# EAGLE schematic Emat (EAGLE 7.5.0)
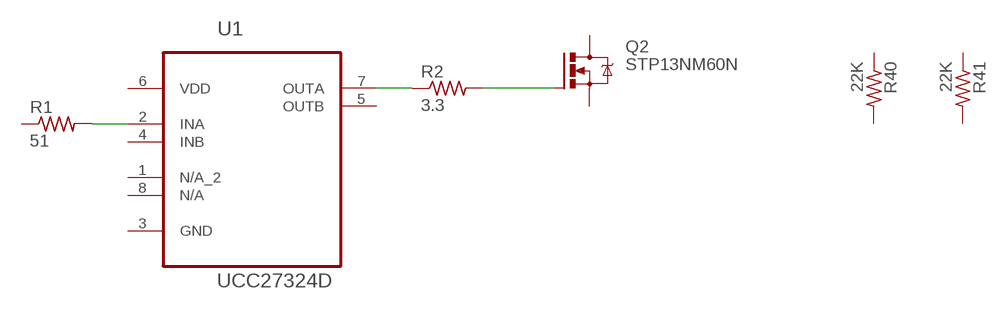
[diagram p0: schematic, sheet 1]

## Parts
Q2  STP13NM60N  [TO220BV]
R1  51  R-US_R1206  [R1206]
R2  3.3  R-US_R1206  [R1206]
R40  22K  R-US_R2512  [R2512]
R41  22K  R-US_R2512  [R2512]
U1  UCC27324D  [SOIC127P600X175-8N]

## Nets
N$1: R1.2 U1.2(INA)
N$2: R2.1 U1.7(OUTA)
N$3: Q2.G R2.2
Unconnected: Q2.D Q2.S R1.1 R40.1 R40.2 R41.1 R41.2 U1.1(N/A_2) U1.3(GND) U1.4(INB) U1.5(OUTB) U1.8(N/A)

## Power pins joined to a net without a drawn wire
VDD: U1.6(VDD)

## Library data of the parts
Q2 = transistor-power:STP13NM60N: N-CHANNEL MOS FET
R1 R2 R40 R41 = rcl:R-US_: RESISTOR, American symbol
U1 = UCC27324D:UCC27324D: DUAL 4-A PEAK HIGH SPEED LOW- SIDE POWER MOSFET DRIVERS